# Altium project STEPPER-Board-v1.0.PrjPcb (part 7 of 7)

## Sheet DIO_Isolation_Sheet.SchDoc
size 420 x 297 mm; SheetNumber: 14; SheetTotal: 14
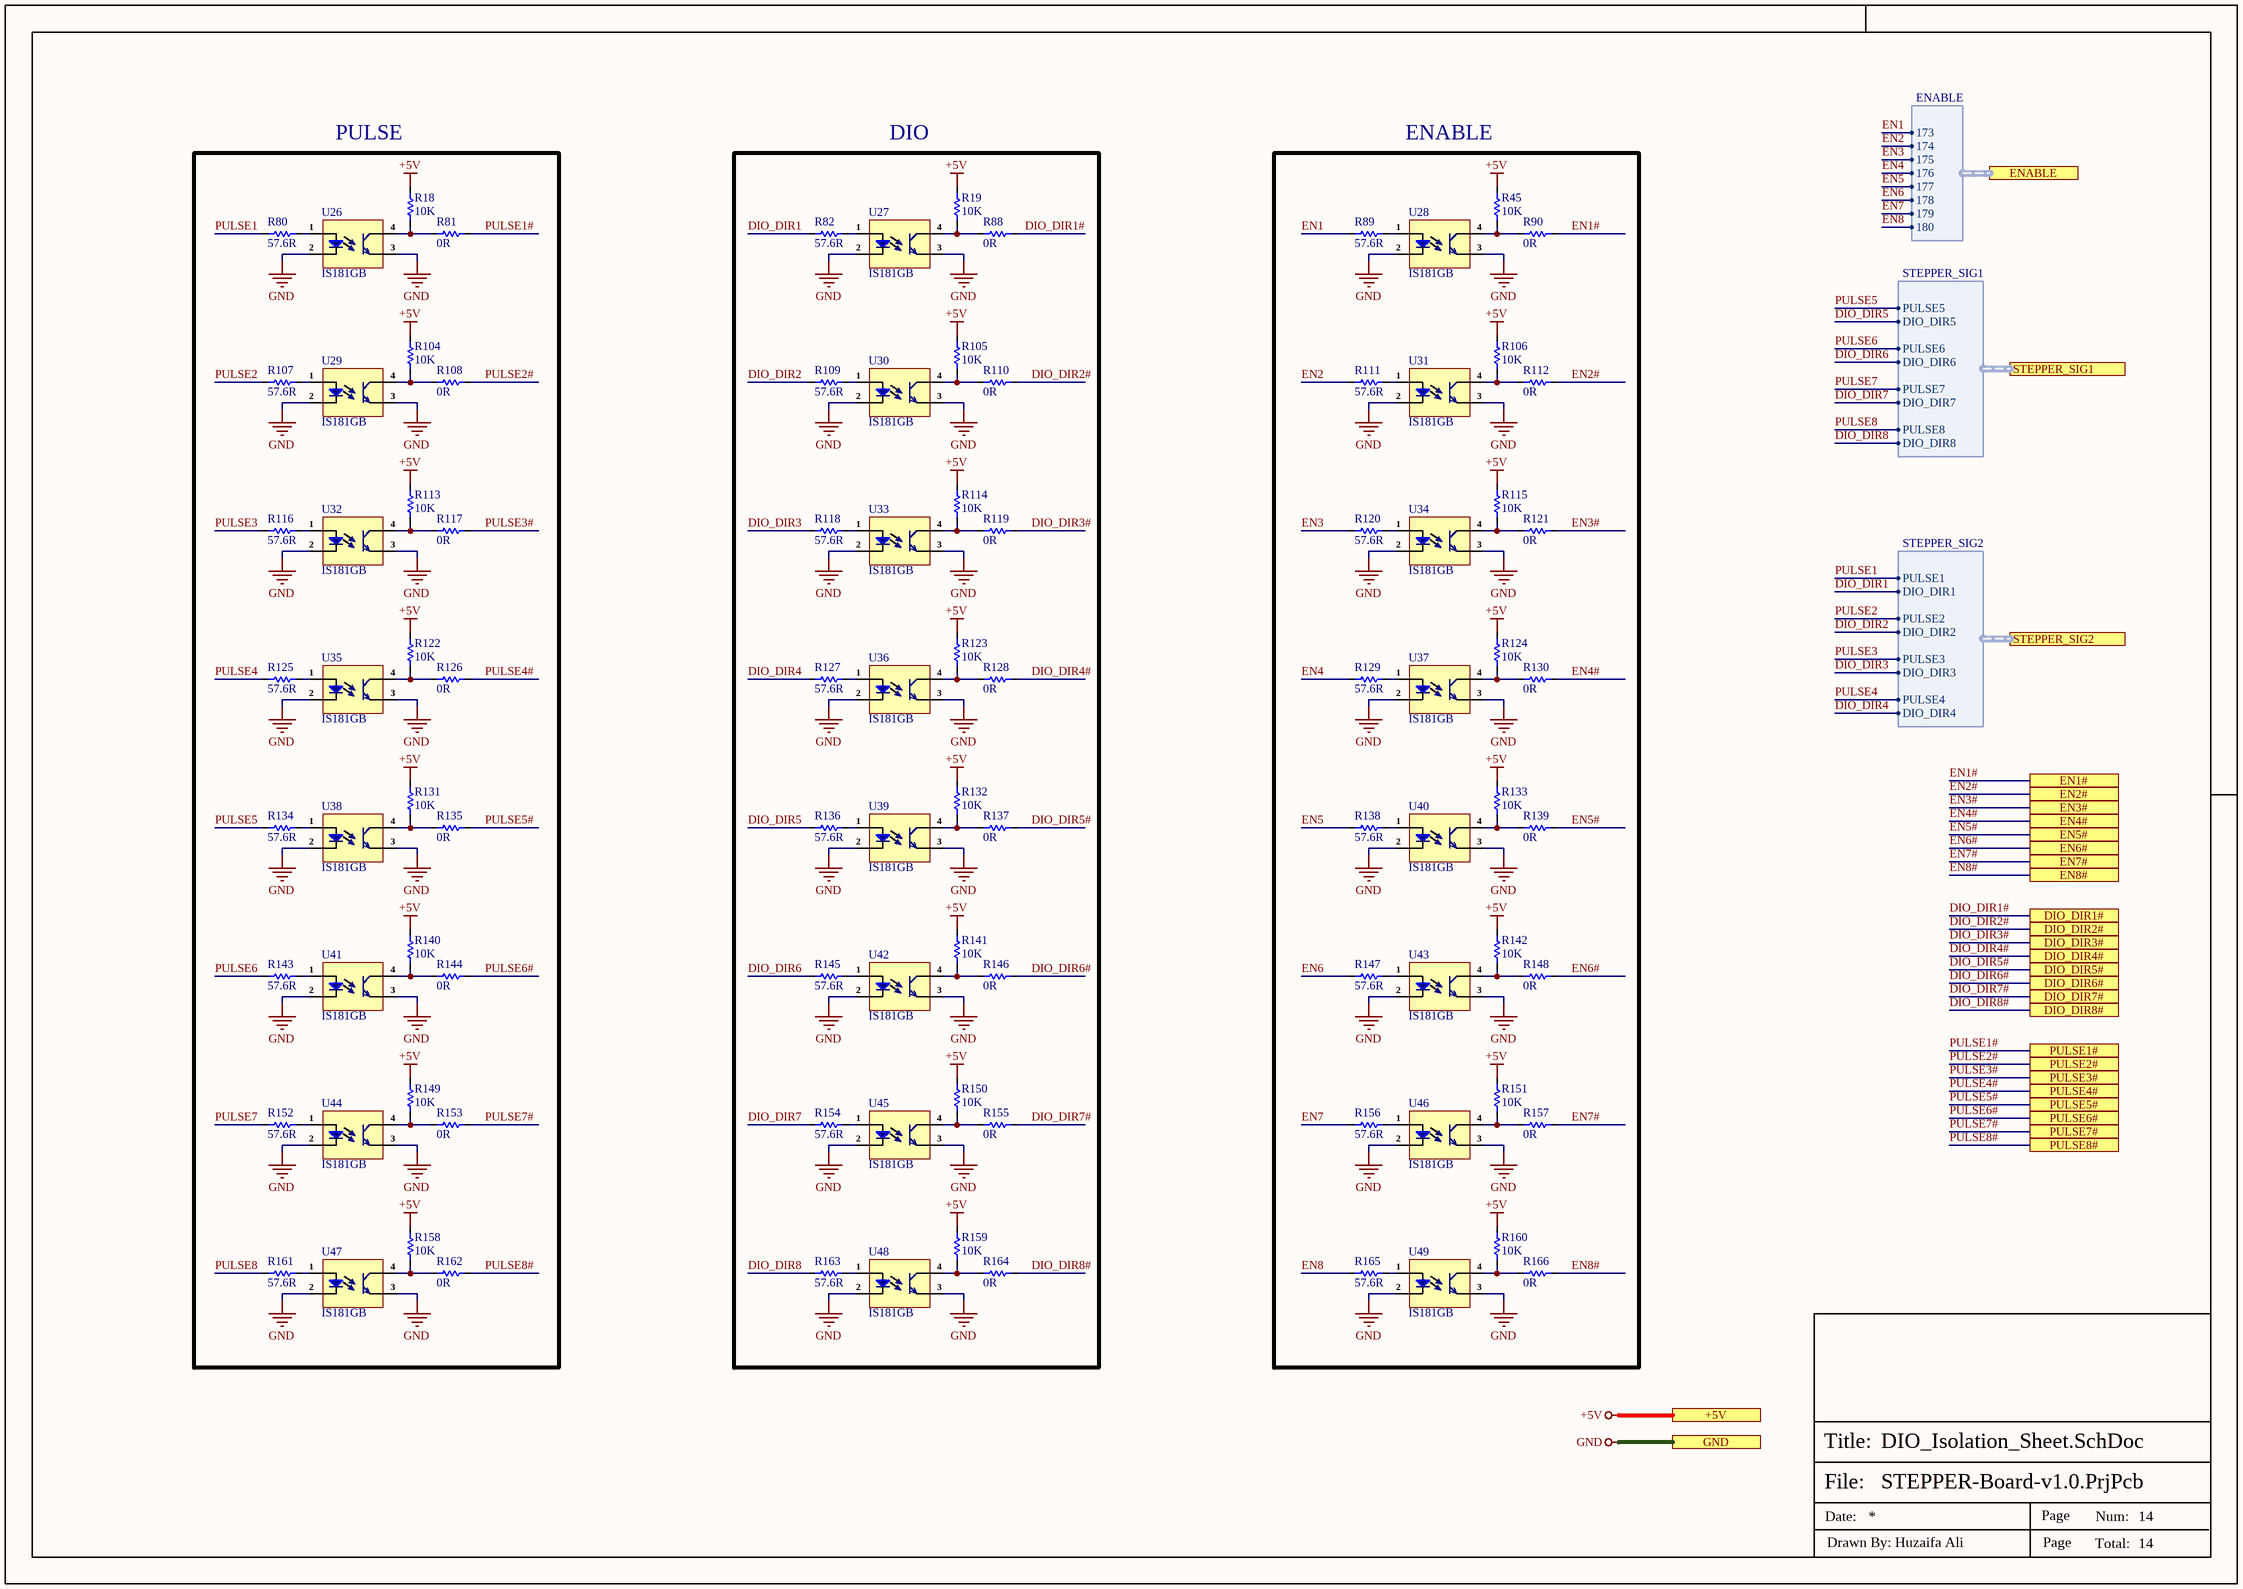
[diagram p13: DIO_Isolation_Sheet.SchDoc]

### Parts
R18  10K  [Res-0402]
R19  10K  [Res-0402]
R45  10K  [Res-0402]
R80  57.6R  [Res-0402]
R81  0R  [Res-0402]
R82  57.6R  [Res-0402]
R88  0R  [Res-0402]
R89  57.6R  [Res-0402]
R90  0R  [Res-0402]
R104  10K  [Res-0402]
R105  10K  [Res-0402]
R106  10K  [Res-0402]
R107  57.6R  [Res-0402]
R108  0R  [Res-0402]
R109  57.6R  [Res-0402]
R110  0R  [Res-0402]
R111  57.6R  [Res-0402]
R112  0R  [Res-0402]
R113  10K  [Res-0402]
R114  10K  [Res-0402]
R115  10K  [Res-0402]
R116  57.6R  [Res-0402]
R117  0R  [Res-0402]
R118  57.6R  [Res-0402]
R119  0R  [Res-0402]
R120  57.6R  [Res-0402]
R121  0R  [Res-0402]
R122  10K  [Res-0402]
R123  10K  [Res-0402]
R124  10K  [Res-0402]
R125  57.6R  [Res-0402]
R126  0R  [Res-0402]
R127  57.6R  [Res-0402]
R128  0R  [Res-0402]
R129  57.6R  [Res-0402]
R130  0R  [Res-0402]
R131  10K  [Res-0402]
R132  10K  [Res-0402]
R133  10K  [Res-0402]
R134  57.6R  [Res-0402]
R135  0R  [Res-0402]
R136  57.6R  [Res-0402]
R137  0R  [Res-0402]
R138  57.6R  [Res-0402]
R139  0R  [Res-0402]
R140  10K  [Res-0402]
R141  10K  [Res-0402]
R142  10K  [Res-0402]
R143  57.6R  [Res-0402]
R144  0R  [Res-0402]
R145  57.6R  [Res-0402]
R146  0R  [Res-0402]
R147  57.6R  [Res-0402]
R148  0R  [Res-0402]
R149  10K  [Res-0402]
R150  10K  [Res-0402]
R151  10K  [Res-0402]
R152  57.6R  [Res-0402]
R153  0R  [Res-0402]
R154  57.6R  [Res-0402]
R155  0R  [Res-0402]
R156  57.6R  [Res-0402]
R157  0R  [Res-0402]
R158  10K  [Res-0402]
R159  10K  [Res-0402]
R160  10K  [Res-0402]
R161  57.6R  [Res-0402]
R162  0R  [Res-0402]
R163  57.6R  [Res-0402]
R164  0R  [Res-0402]
R165  57.6R  [Res-0402]
R166  0R  [Res-0402]
U26  IS181GB  [SOP-4_2.54]
U27  IS181GB  [SOP-4_2.54]
U28  IS181GB  [SOP-4_2.54]
U29  IS181GB  [SOP-4_2.54]
U30  IS181GB  [SOP-4_2.54]
U31  IS181GB  [SOP-4_2.54]
U32  IS181GB  [SOP-4_2.54]
U33  IS181GB  [SOP-4_2.54]
U34  IS181GB  [SOP-4_2.54]
U35  IS181GB  [SOP-4_2.54]
U36  IS181GB  [SOP-4_2.54]
U37  IS181GB  [SOP-4_2.54]
U38  IS181GB  [SOP-4_2.54]
U39  IS181GB  [SOP-4_2.54]
U40  IS181GB  [SOP-4_2.54]
U41  IS181GB  [SOP-4_2.54]
U42  IS181GB  [SOP-4_2.54]
U43  IS181GB  [SOP-4_2.54]
U44  IS181GB  [SOP-4_2.54]
U45  IS181GB  [SOP-4_2.54]
U46  IS181GB  [SOP-4_2.54]
U47  IS181GB  [SOP-4_2.54]
U48  IS181GB  [SOP-4_2.54]
U49  IS181GB  [SOP-4_2.54]

### Ports
+5V (see Top_Sheet[1C], CAN_Sheet[5D], GPIO_EXPANDER_Sheet[5D], Power_Sheet[5D]), DIO_DIR1# (see Top_Sheet[1D], Connector_Sheet[6C]), DIO_DIR2# (see Top_Sheet[1D], Connector_Sheet[6C]), DIO_DIR3# (see Top_Sheet[1D], Connector_Sheet[6C]), DIO_DIR4# (see Top_Sheet[1D], Connector_Sheet[6C]), DIO_DIR5# (see Top_Sheet[1D], Connector_Sheet[6C]), DIO_DIR6# (see Top_Sheet[1D], Connector_Sheet[6C]), DIO_DIR7# (see Top_Sheet[1D], Connector_Sheet[6C]), DIO_DIR8# (see Top_Sheet[1D], Connector_Sheet[6C]), EN1# (see Top_Sheet[2D], Connector_Sheet[6B]), EN2# (see Top_Sheet[2D], Connector_Sheet[6B]), EN3# (see Top_Sheet[2D], Connector_Sheet[6C]), EN4# (see Top_Sheet[2D], Connector_Sheet[6C]), EN5# (see Top_Sheet[2D], Connector_Sheet[6C]), EN6# (see Top_Sheet[2D], Connector_Sheet[6C]), EN7# (see Top_Sheet[2D], Connector_Sheet[6C]), EN8# (see Top_Sheet[2D], Connector_Sheet[6C]), ENABLE (harness ENABLE, see Top_Sheet[2D], GPIO_EXPANDER_Sheet[4D]), GND (see Top_Sheet[1C], CAN_Sheet[5D], Connector_Sheet[5D], Controller_Sheet[5D], EtherCAT_Sheet[5D], GPIO_EXPANDER_Sheet[5D], Power_Sheet[5D], RJ45_Sheet[5D], RS485_RS232_Sheet[2D], Stepper_Driver_Sheet1[5D], Stepper_Driver_Sheet2[5D], Stepper_Driver_Sheet3[5D], Stepper_Driver_Sheet4[5D]), PULSE1# (see Top_Sheet[1C], Connector_Sheet[6C]), PULSE2# (see Top_Sheet[1C], Connector_Sheet[6C]), PULSE3# (see Top_Sheet[1C], Connector_Sheet[6C]), PULSE4# (see Top_Sheet[1C], Connector_Sheet[6C]), PULSE5# (see Top_Sheet[1D], Connector_Sheet[6C]), PULSE6# (see Top_Sheet[1D], Connector_Sheet[6C]), PULSE7# (see Top_Sheet[1D], Connector_Sheet[6C]), PULSE8# (see Top_Sheet[1D], Connector_Sheet[6C]), STEPPER_SIG1 (harness STEPPER_SIG1, see Top_Sheet[2C], Controller_Sheet[1D]), STEPPER_SIG2 (harness STEPPER_SIG2, see Top_Sheet[2C], Controller_Sheet[2D])

### Harnesses
STEPPER_SIG1: PULSE5, DIO_DIR5, PULSE6, DIO_DIR6, PULSE7, DIO_DIR7, PULSE8, DIO_DIR8
STEPPER_SIG2: PULSE1, DIO_DIR1, PULSE2, DIO_DIR2, PULSE3, DIO_DIR3, PULSE4, DIO_DIR4
ENABLE: 173, 174, 175, 176, 177, 178, 179, 180

### Nets
+5V: R18.2 R19.2 R45.2 R104.2 R105.2 R106.2 R113.2 R114.2 R115.2 R122.2 R123.2 R124.2 R131.2 R132.2 R133.2 R140.2 R141.2 R142.2 R149.2 R150.2 R151.2 R158.2 R159.2 R160.2 ; port +5V
GND: U26.2(Ca) U26.3(E) U27.2(Ca) U27.3(E) U28.2(Ca) U28.3(E) U29.2(Ca) U29.3(E) U30.2(Ca) U30.3(E) U31.2(Ca) U31.3(E) U32.2(Ca) U32.3(E) U33.2(Ca) U33.3(E) U34.2(Ca) U34.3(E) U35.2(Ca) U35.3(E) U36.2(Ca) U36.3(E) U37.2(Ca) U37.3(E) U38.2(Ca) U38.3(E) U39.2(Ca) U39.3(E) U40.2(Ca) U40.3(E) U41.2(Ca) U41.3(E) U42.2(Ca) U42.3(E) U43.2(Ca) U43.3(E) U44.2(Ca) U44.3(E) U45.2(Ca) U45.3(E) U46.2(Ca) U46.3(E) U47.2(Ca) U47.3(E) U48.2(Ca) U48.3(E) U49.2(Ca) U49.3(E) ; port GND
DIO_DIR1: R82.1 ; port STEPPER_SIG2.DIO_DIR1
DIO_DIR1#: R88.2 ; port DIO_DIR1#
DIO_DIR2: R109.1 ; port STEPPER_SIG2.DIO_DIR2
DIO_DIR2#: R110.2 ; port DIO_DIR2#
DIO_DIR3: R118.1 ; port STEPPER_SIG2.DIO_DIR3
DIO_DIR3#: R119.2 ; port DIO_DIR3#
DIO_DIR4: R127.1 ; port STEPPER_SIG2.DIO_DIR4
DIO_DIR4#: R128.2 ; port DIO_DIR4#
DIO_DIR5: R136.1 ; port STEPPER_SIG1.DIO_DIR5
DIO_DIR5#: R137.2 ; port DIO_DIR5#
DIO_DIR6: R145.1 ; port STEPPER_SIG1.DIO_DIR6
DIO_DIR6#: R146.2 ; port DIO_DIR6#
DIO_DIR7: R154.1 ; port STEPPER_SIG1.DIO_DIR7
DIO_DIR7#: R155.2 ; port DIO_DIR7#
DIO_DIR8: R163.1 ; port STEPPER_SIG1.DIO_DIR8
DIO_DIR8#: R164.2 ; port DIO_DIR8#
EN1: R89.1 ; port ENABLE.173
EN1#: R90.2 ; port EN1#
EN2: R111.1 ; port ENABLE.174
EN2#: R112.2 ; port EN2#
EN3: R120.1 ; port ENABLE.175
EN3#: R121.2 ; port EN3#
EN4: R129.1 ; port ENABLE.176
EN4#: R130.2 ; port EN4#
EN5: R138.1 ; port ENABLE.177
EN5#: R139.2 ; port EN5#
EN6: R147.1 ; port ENABLE.178
EN6#: R148.2 ; port EN6#
EN7: R156.1 ; port ENABLE.179
EN7#: R157.2 ; port EN7#
EN8: R165.1 ; port ENABLE.180
EN8#: R166.2 ; port EN8#
PULSE1: R80.1 ; port STEPPER_SIG2.PULSE1
PULSE1#: R81.2 ; port PULSE1#
PULSE2: R107.1 ; port STEPPER_SIG2.PULSE2
PULSE2#: R108.2 ; port PULSE2#
PULSE3: R116.1 ; port STEPPER_SIG2.PULSE3
PULSE3#: R117.2 ; port PULSE3#
PULSE4: R125.1 ; port STEPPER_SIG2.PULSE4
PULSE4#: R126.2 ; port PULSE4#
PULSE5: R134.1 ; port STEPPER_SIG1.PULSE5
PULSE5#: R135.2 ; port PULSE5#
PULSE6: R143.1 ; port STEPPER_SIG1.PULSE6
PULSE6#: R144.2 ; port PULSE6#
PULSE7: R152.1 ; port STEPPER_SIG1.PULSE7
PULSE7#: R153.2 ; port PULSE7#
PULSE8: R161.1 ; port STEPPER_SIG1.PULSE8
PULSE8#: R162.2 ; port PULSE8#
NetR18_1: R18.1 R81.1 U26.4(C)
NetR19_1: R19.1 R88.1 U27.4(C)
NetR45_1: R45.1 R90.1 U28.4(C)
NetR80_2: R80.2 U26.1(An)
NetR82_2: R82.2 U27.1(An)
NetR89_2: R89.2 U28.1(An)
NetR104_1: R104.1 R108.1 U29.4(C)
NetR105_1: R105.1 R110.1 U30.4(C)
NetR106_1: R106.1 R112.1 U31.4(C)
NetR107_2: R107.2 U29.1(An)
NetR109_2: R109.2 U30.1(An)
NetR111_2: R111.2 U31.1(An)
NetR113_1: R113.1 R117.1 U32.4(C)
NetR114_1: R114.1 R119.1 U33.4(C)
NetR115_1: R115.1 R121.1 U34.4(C)
NetR116_2: R116.2 U32.1(An)
NetR118_2: R118.2 U33.1(An)
NetR120_2: R120.2 U34.1(An)
NetR122_1: R122.1 R126.1 U35.4(C)
NetR123_1: R123.1 R128.1 U36.4(C)
NetR124_1: R124.1 R130.1 U37.4(C)
NetR125_2: R125.2 U35.1(An)
NetR127_2: R127.2 U36.1(An)
NetR129_2: R129.2 U37.1(An)
NetR131_1: R131.1 R135.1 U38.4(C)
NetR132_1: R132.1 R137.1 U39.4(C)
NetR133_1: R133.1 R139.1 U40.4(C)
NetR134_2: R134.2 U38.1(An)
NetR136_2: R136.2 U39.1(An)
NetR138_2: R138.2 U40.1(An)
NetR140_1: R140.1 R144.1 U41.4(C)
NetR141_1: R141.1 R146.1 U42.4(C)
NetR142_1: R142.1 R148.1 U43.4(C)
NetR143_2: R143.2 U41.1(An)
NetR145_2: R145.2 U42.1(An)
NetR147_2: R147.2 U43.1(An)
NetR149_1: R149.1 R153.1 U44.4(C)
NetR150_1: R150.1 R155.1 U45.4(C)
NetR151_1: R151.1 R157.1 U46.4(C)
NetR152_2: R152.2 U44.1(An)
NetR154_2: R154.2 U45.1(An)
NetR156_2: R156.2 U46.1(An)
NetR158_1: R158.1 R162.1 U47.4(C)
NetR159_1: R159.1 R164.1 U48.4(C)
NetR160_1: R160.1 R166.1 U49.4(C)
NetR161_2: R161.2 U47.1(An)
NetR163_2: R163.2 U48.1(An)
NetR165_2: R165.2 U49.1(An)

### Notes on the sheet
- (near R18) PULSE
- DIO
- (near R45) ENABLE
- File:
- Title:
- Date:
- Page
- Num:
- Total:
- Drawn By: Huzaifa Ali

### Library data of the parts
R18 R19 R45 R104-R106 R113-R115 R122-R124 R131-R133 R140-R142 R149-R151 R158-R160 = RC0402FR-0710KL: RES 10K OHM 1% 1/16W 0402; Manufacturer: Yageo; Resistance: 10kR; Voltage Rating (DC): 50V; Temperature Coefficient: 100ppm/°C; Power Rating: 62.5mW; Max Power Dissipation: 63mW; Item Type: Resistor; Supplier 1: Mouser; Manufacturer Part Number: RC0402FR-0710KL; RoHS: Yes; Category: Chip SMD Resistors; Stock 1: 18648329; Pricing 1: 1=0.10000, 10=0.01400, 50=0.01400, 100=0.00500, 1000=0.00300, 10000=0.00200 (USD); Case/Package: 0402; Number of Pins: 2; Case Code (Imperial): 0402; Case Code (Metric): 1005; Min Operating Temperature: -55°C; Max Operating Temperature: 155°C; Resistor Type: Thick Film; Tolerance: 1%; Packaging: Tape and Reel; Voltage Rating: 50V; Termination: SMD/SMT; Working Voltage: 50V; Number of Terminations: 2; Features: Moisture Resistant; Series: RC; Resistance Tolerance: 1%; Construction: Rectangular; Length: 1mm; Width: 0.5mm; Height: 0.32mm; Depth: 0.5mm; Lead Pitch: 0.2mm; REACH SVHC: No SVHC; Lead Free: Lead Free; RoHS Compliant: Yes; Military Standard: Not; ComponentLink1URL: https://datasheet.ciiva.com/7660/38568-7660787.pdf?src-supplier=Element14; ComponentLink1Description: https://datasheet.ciiva.com/7660/38568-7660787.pdf?src-supplier=Element14; ComponentLink2URL: https://datasheet.ciiva.com/7849/1686128-7849814.pdf?src-supplier=Element14; ComponentLink2Description: https://datasheet.ciiva.com/7849/1686128-7849814.pdf?src-supplier=Element14; ComponentLink3URL: https://datasheet.ciiva.com/7983/1018594-7983486.pdf?src-supplier=Element14; ComponentLink3Description: https://datasheet.ciiva.com/7983/1018594-7983486.pdf?src-supplier=Element14; ComponentLink4URL: https://datasheet.ciiva.com/22747/1018594-22747512.pdf?src-supplier=Element14; ComponentLink4Description: https://datasheet.ciiva.com/22747/1018594-22747512.pdf?src-supplier=Element14; ComponentLink5URL: https://datasheet.ciiva.com/12667/pyu-rc0402-51-rohs-l-6-r-12667067.pdf?src-supplier=Mouser; ComponentLink5Description: https://datasheet.ciiva.com/12667/pyu-rc0402-51-rohs-l-6-r-12667067.pdf?src-supplier=Mouser; ComponentLink6URL: https://datasheet.ciiva.com/7849/1784430-7849813.pdf?src-supplier=Element14; ComponentLink6Description: https://datasheet.ciiva.com/7849/1784430-7849813.pdf?src-supplier=Element14; ComponentLink7URL: https://datasheet.ciiva.com/7849/1784430-7849815.pdf?src-supplier=Element14; ComponentLink7Description: https://datasheet.ciiva.com/7849/1784430-7849815.pdf?src-supplier=Element14; Supplier Part Number 1: 603-RC0402FR-0710KL; LCSC Part Number: C60490
R80 R82 R89 R107 R109 R111 R116 R118 R120 R125 R127 R129 R134 R136 R138 R143 R145 R147 R152 R154 R156 R161 R163 R165 = ERJ-2RKF57R6X: RES SMD 57.6 OHM 1% 1/10W 0402; Manufacturer: Panasonic; Item Type: Resistors; Supplier: Mouser; Supplier Part Number: 667-ERJ-2RKF57R6X; Manufacturer Part Number: ERJ-2RKF57R6X; RoHS: Yes; Stock: 32931; Pricing: 1=0.1, 10=0.015, 50=0.015, 100=0.009, 1000=0.006, 10000=0.003 (USD); ComponentLink1URL: https://datasheet.ciiva.com/9188/aoa0000ce2-9188571.pdf?src-supplier=Avnet; ComponentLink1Description: https://datasheet.ciiva.com/9188/aoa0000ce2-9188571.pdf?src-supplier=Avnet; ComponentLink2URL: https://datasheet.ciiva.com/9188/aoa0000ce2-9188574.pdf?src-supplier=Avnet; ComponentLink2Description: https://datasheet.ciiva.com/9188/aoa0000ce2-9188574.pdf?src-supplier=Avnet; ComponentLink3URL: https://datasheet.ciiva.com/24026/aoa0000ce2-24026248.pdf?src-supplier=Mouser; ComponentLink3Description: https://datasheet.ciiva.com/24026/aoa0000ce2-24026248.pdf?src-supplier=Mouser; ComponentLink4URL: https://datasheet.ciiva.com/43467/1678782-43467198.pdf?src-supplier=Farnell; ComponentLink4Description: https://datasheet.ciiva.com/43467/1678782-43467198.pdf?src-supplier=Farnell; ComponentLink5URL: https://datasheet.ciiva.com/46372/1678782-46372935.pdf?src-supplier=Element14; ComponentLink5Description: https://datasheet.ciiva.com/46372/1678782-46372935.pdf?src-supplier=Element14; ComponentLink6URL: https://datasheet.ciiva.com/46372/1678782-46372936.pdf?src-supplier=Element14; ComponentLink6Description: https://datasheet.ciiva.com/46372/1678782-46372936.pdf?src-supplier=Element14; ComponentLink7URL: https://datasheet.ciiva.com/22668/1678782-22668391.pdf?src-supplier=Element14; ComponentLink7Description: https://datasheet.ciiva.com/22668/1678782-22668391.pdf?src-supplier=Element14; ComponentLink8URL: https://datasheet.ciiva.com/22743/1678782-22743894.pdf?src-supplier=Element14; ComponentLink8Description: https://datasheet.ciiva.com/22743/1678782-22743894.pdf?src-supplier=Element14; ComponentLink9URL: https://datasheet.ciiva.com/30107/aoa0000ce2-30107676.pdf?src-supplier=Onlinecomponents.com; ComponentLink9Description: https://datasheet.ciiva.com/30107/aoa0000ce2-30107676.pdf?src-supplier=Onlinecomponents.com; LCSC Part Number: C3025671
R81 R88 R90 R108 R110 R112 R117 R119 R121 R126 R128 R130 R135 R137 R139 R144 R146 R148 R153 R155 R157 R162 R164 R166 = RC0402FR-070RL: RES 0 OHM JUMPER 1/16W 0402; Manufacturer: Yageo; Item Type: Resistors; Tolerance: 1%; Power Rating: 62.5mW; Voltage Rating: 50V; Temperature Coefficient: 200ppm/°C; Max Power Dissipation: 63mW; Supplier 1: Mouser; Manufacturer Part Number: RC0402FR-070RL; RoHS: Yes; Stock 1: 8556842; Pricing 1: 1=0.10000, 10=0.01400, 50=0.01400, 100=0.00600, 1000=0.00300, 5000=0.00200, 10000=0.00100 (USD); Mount: Surface Mount; Case/Package: 0402; Contact Plating: Tin,Matte; Case Code (Imperial): 0402; Case Code (Metric): 1005; Size Code: 0402; Min Operating Temperature: -55°C; Max Operating Temperature: 155°C; Resistance: 0R; Resistor Type: Thick Film; Packaging: Tape and Reel; Termination: SMD/SMT; Features: Moisture Resistant; Series: RC; Number of Terminations: 2; Length: 1mm; Width: 0.5mm; Height: 0.35mm; Radiation Hardening: No; Lead Free: Lead Free; RoHS Compliant: Yes; ComponentLink1URL: https://datasheet.ciiva.com/8896/pyu-rc0402-51-rohs-l-6-8896149.pdf?src-supplier=Avnet; ComponentLink1Description: https://datasheet.ciiva.com/8896/pyu-rc0402-51-rohs-l-6-8896149.pdf?src-supplier=Avnet; ComponentLink2URL: https://datasheet.ciiva.com/16790/pyu-rc0402-51-rohs-l-6-r-16790444.pdf?src-supplier=Future+Electronics; ComponentLink2Description: https://datasheet.ciiva.com/16790/pyu-rc0402-51-rohs-l-6-r-16790444.pdf?src-supplier=Future+Electronics; Supplier Part Number 1: 603-RC0402FR-070RL; LCSC Part Number: C106231
U26-U49 = IS181GB: Optoisolator Transistor Output 3750Vrms 1 Channel; Manufacturer: Isocom; Forward Current: 50mA; Reverse Breakdown Voltage: 6V; Isolation Voltage: 3.75kV; Rise Time: 18000ns; Power Dissipation: 170mW; Number of Elements: 1; Collector Emitter Saturation Voltage: 200mV; Forward Voltage: 1.4V; Collector Emitter Voltage (VCEO): 80V; Current Transfer Ratio: 600%; Item Type: Optocoupler; Supplier 1: Arrow Electronics; Manufacturer Part Number: IS181GB; RoHS: Yes; Category: Optocouplers; Stock 1: 2922; Pricing 1: 1=0.55080, 10=0.34190, 25=0.33860, 50=0.33530, 100=0.19360, 250=0.19160, 500=0.18960, 1000=0.14750 (USD); Mount: Surface Mount; Case/Package: SMD/SMT; Number of Pins: 4; Min Operating Temperature: -55°C; Max Operating Temperature: 100°C; Fall Time: 18000ns; Radiation Hardening: No; Lead Free: Lead Free; RoHS Compliant: Yes; ComponentLink1URL: https://datasheet.ciiva.com/26895/getdatasheetpartid-624485-26895717.pdf?src-supplier=Verical; ComponentLink1Description: https://datasheet.ciiva.com/26895/getdatasheetpartid-624485-26895717.pdf?src-supplier=Verical; ComponentLink2URL: https://datasheet.ciiva.com/29301/183289-da-01-en-optokoppler-is181-gb-29301106.pdf?src-supplier=Conrad; ComponentLink2Description: https://datasheet.ciiva.com/29301/183289-da-01-en-optokoppler-is181-gb-29301106.pdf?src-supplier=Conrad; Supplier Part Number 1: IS181GB; LCSC Part Number: C84196

## Nets that join several sheets
+3V3: CAN_Sheet (C21.2 U5.5), Controller_Sheet (13 pins), EtherCAT_Sheet (19 pins), GPIO_EXPANDER_Sheet (17 pins), Power_Sheet (C13.2 R17.1 TP3.1 U3.3), RJ45_Sheet (12 pins), RS485_RS232_Sheet (9 pins), Stepper_Driver_Sheet1 (R49.1 R167.2), Stepper_Driver_Sheet2 (R56.1 R168.2), Stepper_Driver_Sheet3 (R63.1 R169.2), Stepper_Driver_Sheet4 (R70.1 R170.2)
+5V: CAN_Sheet (5 pins), Connector_Sheet (16 pins), Power_Sheet (9 pins), DIO_Isolation_Sheet (24 pins)
+24V: Connector_Sheet (J20.2), Power_Sheet (11 pins), Stepper_Driver_Sheet1 (8 pins), Stepper_Driver_Sheet2 (12 pins), Stepper_Driver_Sheet3 (12 pins), Stepper_Driver_Sheet4 (12 pins)
GND: CAN_Sheet (7 pins), Connector_Sheet (34 pins), Controller_Sheet (27 pins), EtherCAT_Sheet (26 pins), GPIO_EXPANDER_Sheet (11 pins), Power_Sheet (19 pins), RJ45_Sheet (10 pins), RS485_RS232_Sheet (12 pins), Stepper_Driver_Sheet1 (15 pins), Stepper_Driver_Sheet2 (15 pins), Stepper_Driver_Sheet3 (15 pins), Stepper_Driver_Sheet4 (15 pins), DIO_Isolation_Sheet (48 pins)
RS232_RX: Connector_Sheet (J14.1), RS485_RS232_Sheet (F3.1 TP7.1)
RS232_TX: Connector_Sheet (J14.2), RS485_RS232_Sheet (F4.1 TP8.1)
RXD/RS485: Controller_Sheet (U1.19), RS485_RS232_Sheet (R27.1 TP9.1 U7.4)
TXD/RS485: Controller_Sheet (U1.20), RS485_RS232_Sheet (R24.1 TP10.1 U7.1)
AOUTM1_1: Connector_Sheet (J9.1), Stepper_Driver_Sheet1 (Q1.3 Q2.2 U10.37)
AOUTM1_2: Connector_Sheet (J9.2), Stepper_Driver_Sheet1 (Q3.3 Q4.2 U10.30)
AOUTM2_1: Connector_Sheet (J10.1), Stepper_Driver_Sheet2 (U4.1 U4.5 U4.6 U11.37)
AOUTM2_2: Connector_Sheet (J10.2), Stepper_Driver_Sheet2 (U11.30 U15.1 U15.5 U15.6)
AOUTM3_1: Connector_Sheet (J15.1), Stepper_Driver_Sheet3 (U12.37 U18.1 U18.5 U18.6)
AOUTM3_2: Connector_Sheet (J15.2), Stepper_Driver_Sheet3 (U12.30 U19.1 U19.5 U19.6)
AOUTM4_1: Connector_Sheet (J17.1), Stepper_Driver_Sheet4 (U13.37 U22.1 U22.5 U22.6)
AOUTM4_2: Connector_Sheet (J17.2), Stepper_Driver_Sheet4 (U13.30 U23.1 U23.5 U23.6)
BEMF1: Controller_Sheet (U1.3), Stepper_Driver_Sheet1 (C39.2 U10.20)
BEMF2: Controller_Sheet (U1.15), Stepper_Driver_Sheet2 (C46.2 U11.20)
BEMF3: Controller_Sheet (U1.27), Stepper_Driver_Sheet3 (C53.2 U12.20)
BEMF4: Controller_Sheet (U1.28), Stepper_Driver_Sheet4 (C60.2 U13.20)
BOUTM1_1: Connector_Sheet (J9.3), Stepper_Driver_Sheet1 (Q5.3 Q6.2 U10.28)
BOUTM1_2: Connector_Sheet (J9.4), Stepper_Driver_Sheet1 (Q7.3 Q8.2 U10.21)
BOUTM2_1: Connector_Sheet (J10.3), Stepper_Driver_Sheet2 (U11.28 U16.1 U16.5 U16.6)
BOUTM2_2: Connector_Sheet (J10.4), Stepper_Driver_Sheet2 (U11.21 U17.1 U17.5 U17.6)
BOUTM3_1: Connector_Sheet (J15.3), Stepper_Driver_Sheet3 (U12.28 U20.1 U20.5 U20.6)
BOUTM3_2: Connector_Sheet (J15.4), Stepper_Driver_Sheet3 (U12.21 U21.1 U21.5 U21.6)
BOUTM4_1: Connector_Sheet (J17.3), Stepper_Driver_Sheet4 (U13.28 U24.1 U24.5 U24.6)
BOUTM4_2: Connector_Sheet (J17.4), Stepper_Driver_Sheet4 (U13.21 U25.1 U25.5 U25.6)
CAN_N: CAN_Sheet (R23.2 U5.12), Connector_Sheet (J12.2)
CAN_P: CAN_Sheet (R21.1 U5.13), Connector_Sheet (J12.1)
CAN_RX: CAN_Sheet (U5.4), Controller_Sheet (U1.25)
CAN_TX: CAN_Sheet (U5.1), Controller_Sheet (U1.26)
DIO_DIR1: Controller_Sheet (U1.54), DIO_Isolation_Sheet (R82.1)
DIO_DIR1#: Connector_Sheet (J8.2), DIO_Isolation_Sheet (R88.2)
DIO_DIR2: Controller_Sheet (U1.52), DIO_Isolation_Sheet (R109.1)
DIO_DIR2#: Connector_Sheet (J11.2), DIO_Isolation_Sheet (R110.2)
DIO_DIR3: Controller_Sheet (U1.49), DIO_Isolation_Sheet (R118.1)
DIO_DIR3#: Connector_Sheet (J16.2), DIO_Isolation_Sheet (R119.2)
DIO_DIR4: Controller_Sheet (U1.47), DIO_Isolation_Sheet (R127.1)
DIO_DIR4#: Connector_Sheet (J22.2), DIO_Isolation_Sheet (R128.2)
DIO_DIR5: Controller_Sheet (U1.34), DIO_Isolation_Sheet (R136.1)
DIO_DIR5#: Connector_Sheet (J23.2), DIO_Isolation_Sheet (R137.2)
DIO_DIR6: Controller_Sheet (U1.40), DIO_Isolation_Sheet (R145.1)
DIO_DIR6#: Connector_Sheet (J24.2), DIO_Isolation_Sheet (R146.2)
DIO_DIR7: Controller_Sheet (U1.38), DIO_Isolation_Sheet (R154.1)
DIO_DIR7#: Connector_Sheet (J25.2), DIO_Isolation_Sheet (R155.2)
DIO_DIR8: Controller_Sheet (U1.36), DIO_Isolation_Sheet (R163.1)
DIO_DIR8#: Connector_Sheet (J26.2), DIO_Isolation_Sheet (R164.2)
DIR1: Controller_Sheet (U1.62), Stepper_Driver_Sheet1 (U10.11)
DIR2: Controller_Sheet (U1.60), Stepper_Driver_Sheet2 (U11.11)
DIR3: Controller_Sheet (U1.58), Stepper_Driver_Sheet3 (U12.11)
DIR4: Controller_Sheet (U1.56), Stepper_Driver_Sheet4 (U13.11)
EN1: GPIO_EXPANDER_Sheet (U8.21), DIO_Isolation_Sheet (R89.1)
EN1#: Connector_Sheet (J8.1), DIO_Isolation_Sheet (R90.2)
EN2: GPIO_EXPANDER_Sheet (U8.22), DIO_Isolation_Sheet (R111.1)
EN2#: Connector_Sheet (J11.1), DIO_Isolation_Sheet (R112.2)
EN3: GPIO_EXPANDER_Sheet (U8.23), DIO_Isolation_Sheet (R120.1)
EN3#: Connector_Sheet (J16.1), DIO_Isolation_Sheet (R121.2)
EN4: GPIO_EXPANDER_Sheet (U8.24), DIO_Isolation_Sheet (R129.1)
EN4#: Connector_Sheet (J22.1), DIO_Isolation_Sheet (R130.2)
EN5: GPIO_EXPANDER_Sheet (U8.25), DIO_Isolation_Sheet (R138.1)
EN5#: Connector_Sheet (J23.1), DIO_Isolation_Sheet (R139.2)
EN6: GPIO_EXPANDER_Sheet (U8.26), DIO_Isolation_Sheet (R147.1)
EN6#: Connector_Sheet (J24.1), DIO_Isolation_Sheet (R148.2)
EN7: GPIO_EXPANDER_Sheet (U8.27), DIO_Isolation_Sheet (R156.1)
EN7#: Connector_Sheet (J25.1), DIO_Isolation_Sheet (R157.2)
EN8: GPIO_EXPANDER_Sheet (U8.28), DIO_Isolation_Sheet (R165.1)
EN8#: Connector_Sheet (J26.1), DIO_Isolation_Sheet (R166.2)
EN_CAN: CAN_Sheet (U5.6), Controller_Sheet (U1.23)
FAULTN1: GPIO_EXPANDER_Sheet (R35.2 U9.21), Stepper_Driver_Sheet1 (LED4.2 U10.18)
FAULTN2: GPIO_EXPANDER_Sheet (R36.2 U9.22), Stepper_Driver_Sheet2 (LED5.2 U11.18)
FAULTN3: GPIO_EXPANDER_Sheet (R39.2 U9.23), Stepper_Driver_Sheet3 (LED8.2 U12.18)
FAULTN4: GPIO_EXPANDER_Sheet (R40.2 U9.24), Stepper_Driver_Sheet4 (LED9.2 U13.18)
I2C3_SCL: Controller_Sheet (R101.2 U1.13), GPIO_EXPANDER_Sheet (U8.12 U9.12)
I2C3_SDA: Controller_Sheet (R102.2 U1.14), GPIO_EXPANDER_Sheet (U8.13 U9.13)
INH_MASK: CAN_Sheet (U5.11), Controller_Sheet (U1.24)
LEDPOL0: EtherCAT_Sheet (R99.2 U14.48), RJ45_Sheet (R14.1)
LEDPOL1: EtherCAT_Sheet (R100.2 U14.46), RJ45_Sheet (R15.1)
nFAULT_CAN: CAN_Sheet (U5.8), Controller_Sheet (U1.21)
nSTB_CAN: CAN_Sheet (U5.14), Controller_Sheet (U1.22)
PULSE1: Controller_Sheet (U1.55), DIO_Isolation_Sheet (R80.1)
PULSE1#: Connector_Sheet (J8.3), DIO_Isolation_Sheet (R81.2)
PULSE2: Controller_Sheet (U1.53), DIO_Isolation_Sheet (R107.1)
PULSE2#: Connector_Sheet (J11.3), DIO_Isolation_Sheet (R108.2)
PULSE3: Controller_Sheet (U1.50), DIO_Isolation_Sheet (R116.1)
PULSE3#: Connector_Sheet (J16.3), DIO_Isolation_Sheet (R117.2)
PULSE4: Controller_Sheet (U1.48), DIO_Isolation_Sheet (R125.1)
PULSE4#: Connector_Sheet (J22.3), DIO_Isolation_Sheet (R126.2)
PULSE5: Controller_Sheet (U1.42), DIO_Isolation_Sheet (R134.1)
PULSE5#: Connector_Sheet (J23.3), DIO_Isolation_Sheet (R135.2)
PULSE6: Controller_Sheet (U1.41), DIO_Isolation_Sheet (R143.1)
PULSE6#: Connector_Sheet (J24.3), DIO_Isolation_Sheet (R144.2)
PULSE7: Controller_Sheet (U1.39), DIO_Isolation_Sheet (R152.1)
PULSE7#: Connector_Sheet (J25.3), DIO_Isolation_Sheet (R153.2)
PULSE8: Controller_Sheet (U1.37), DIO_Isolation_Sheet (R161.1)
PULSE8#: Connector_Sheet (J26.3), DIO_Isolation_Sheet (R162.2)
RE/DE/RS485/T: Controller_Sheet (U1.16), RS485_RS232_Sheet (R25.1 R26.1 U7.2 U7.3)
RESET1: GPIO_EXPANDER_Sheet (U9.1), Stepper_Driver_Sheet1 (U10.9)
RESET2: GPIO_EXPANDER_Sheet (U9.2), Stepper_Driver_Sheet2 (U11.9)
RESET3: GPIO_EXPANDER_Sheet (U9.3), Stepper_Driver_Sheet3 (U12.9)
RESET4: GPIO_EXPANDER_Sheet (U9.4), Stepper_Driver_Sheet4 (U13.9)
RS485_N: Connector_Sheet (J13.1), RS485_RS232_Sheet (F1.2)
RS485_P: Connector_Sheet (J13.2), RS485_RS232_Sheet (F2.2)
RXA_N: EtherCAT_Sheet (U14.54), RJ45_Sheet (C61.2 J18.6 R75.1)
RXA_P: EtherCAT_Sheet (U14.55), RJ45_Sheet (C62.2 J18.3 R76.1)
RXB_N: EtherCAT_Sheet (U14.61), RJ45_Sheet (C67.2 J19.6 R83.1)
RXB_P: EtherCAT_Sheet (U14.60), RJ45_Sheet (C68.2 J19.3 R84.1)
RXD/RS232: Controller_Sheet (U1.31), RS485_RS232_Sheet (U6.9)
SCLK: Controller_Sheet (U1.64), Stepper_Driver_Sheet1 (U10.14), Stepper_Driver_Sheet2 (U11.14), Stepper_Driver_Sheet3 (U12.14), Stepper_Driver_Sheet4 (U13.14)
SCS1: GPIO_EXPANDER_Sheet (U8.1), Stepper_Driver_Sheet1 (U10.16)
SCS2: GPIO_EXPANDER_Sheet (U8.2), Stepper_Driver_Sheet2 (U11.16)
SCS3: GPIO_EXPANDER_Sheet (U8.3), Stepper_Driver_Sheet3 (U12.16)
SCS4: GPIO_EXPANDER_Sheet (U8.4), Stepper_Driver_Sheet4 (U13.16)
SDAI: Controller_Sheet (U1.2), Stepper_Driver_Sheet1 (U10.15), Stepper_Driver_Sheet2 (U11.15), Stepper_Driver_Sheet3 (U12.15), Stepper_Driver_Sheet4 (U13.15)
SDAO: Controller_Sheet (R1.2 U1.1), Stepper_Driver_Sheet1 (U10.17), Stepper_Driver_Sheet2 (U11.17), Stepper_Driver_Sheet3 (U12.17), Stepper_Driver_Sheet4 (U13.17)
SLEEP1: GPIO_EXPANDER_Sheet (U8.5), Stepper_Driver_Sheet1 (R49.2 U10.8)
SLEEP2: GPIO_EXPANDER_Sheet (U8.6), Stepper_Driver_Sheet2 (R56.2 U11.8)
SLEEP3: GPIO_EXPANDER_Sheet (U8.7), Stepper_Driver_Sheet3 (R63.2 U12.8)
SLEEP4: GPIO_EXPANDER_Sheet (U8.8), Stepper_Driver_Sheet4 (R70.2 U13.8)
SPI2_MISO: Controller_Sheet (U1.29), EtherCAT_Sheet (U14.13)
SPI2_MOSI: Controller_Sheet (U1.35), EtherCAT_Sheet (U14.17)
SPI2_NSS: Controller_Sheet (U1.32), EtherCAT_Sheet (U14.50)
SPI2_SCK: Controller_Sheet (U1.51), EtherCAT_Sheet (U14.19)
STALL1: GPIO_EXPANDER_Sheet (R41.2 U9.25), Stepper_Driver_Sheet1 (U10.19)
STALL2: GPIO_EXPANDER_Sheet (R42.2 U9.26), Stepper_Driver_Sheet2 (U11.19)
STALL3: GPIO_EXPANDER_Sheet (R43.2 U9.27), Stepper_Driver_Sheet3 (U12.19)
STALL4: GPIO_EXPANDER_Sheet (R44.2 U9.28), Stepper_Driver_Sheet4 (U13.19)
STEP1: Controller_Sheet (U1.63), Stepper_Driver_Sheet1 (U10.10)
STEP2: Controller_Sheet (U1.61), Stepper_Driver_Sheet2 (U11.10)
STEP3: Controller_Sheet (U1.59), Stepper_Driver_Sheet3 (U12.10)
STEP4: Controller_Sheet (U1.57), Stepper_Driver_Sheet4 (U13.10)
SYNC0: EtherCAT_Sheet (U14.34), GPIO_EXPANDER_Sheet (U9.6)
SYNC1: EtherCAT_Sheet (U14.18), GPIO_EXPANDER_Sheet (U9.5)
TXA_N: EtherCAT_Sheet (U14.52), RJ45_Sheet (C63.2 J18.2 R77.1)
TXA_P: EtherCAT_Sheet (U14.53), RJ45_Sheet (C64.2 J18.1 R78.1)
TXB_N: EtherCAT_Sheet (U14.63), RJ45_Sheet (C69.2 J19.2 R85.1)
TXB_P: EtherCAT_Sheet (U14.62), RJ45_Sheet (C70.2 J19.1 R86.1)
TXD/RS232: Controller_Sheet (U1.30), RS485_RS232_Sheet (U6.10)